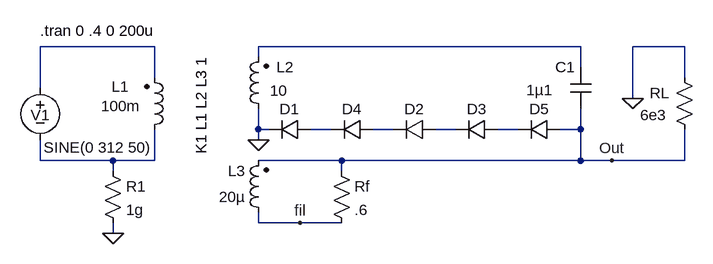
[diagram p0: schematic FteMicrondas.asc]
FteMicrondas.asc, the LTspice schematic file:
Version 4
SHEET 1 880 680
WIRE 0 112 -176 112
WIRE 656 112 160 112
WIRE 816 112 736 112
WIRE 160 128 160 112
WIRE 656 144 656 112
WIRE 0 160 0 112
WIRE 816 160 816 112
WIRE -176 176 -176 112
WIRE 736 192 736 112
WIRE 160 240 160 208
WIRE 176 240 160 240
WIRE 272 240 240 240
WIRE 368 240 336 240
WIRE 464 240 432 240
WIRE 560 240 528 240
WIRE 656 240 656 208
WIRE 656 240 624 240
WIRE 160 256 160 240
WIRE -176 288 -176 256
WIRE -64 288 -176 288
WIRE 0 288 0 240
WIRE 0 288 -64 288
WIRE 288 288 160 288
WIRE 656 288 656 240
WIRE 656 288 288 288
WIRE 704 288 656 288
WIRE 816 288 816 240
WIRE 816 288 704 288
WIRE -64 304 -64 288
WIRE 288 304 288 288
WIRE 160 384 160 368
WIRE 224 384 160 384
WIRE 288 384 224 384
WIRE -64 400 -64 384
FLAG 160 256 0
FLAG -64 400 0
FLAG 704 288 Out
FLAG 224 384 fil
FLAG 736 192 0
SYMBOL ind2 176 224 R180
WINDOW 0 -39 80 Left 0
WINDOW 3 -29 44 Left 0
SYMATTR InstName L2
SYMATTR Value 10
SYMATTR SpiceLine Rser=1
SYMBOL ind2 176 384 R180
WINDOW 0 36 80 Left 0
WINDOW 3 36 40 Left 0
SYMATTR InstName L3
SYMATTR Value 20µ
SYMBOL ind2 -16 256 M180
WINDOW 0 -50 82 Left 0
WINDOW 3 -66 52 Left 0
SYMATTR InstName L1
SYMATTR Value 100m
SYMATTR SpiceLine Rser=.1
SYMBOL voltage -176 160 R0
WINDOW 0 -15 58 Left 0
WINDOW 3 5 108 Left 0
WINDOW 123 0 0 Left 0
WINDOW 39 0 0 Left 0
SYMATTR InstName V1
SYMATTR Value SINE(0 312 50)
SYMBOL res -80 288 R0
SYMATTR InstName R1
SYMATTR Value 1g
SYMBOL diode 240 256 M270
WINDOW 0 32 32 VTop 0
WINDOW 3 59 -30 Invisible 0
SYMATTR InstName D1
SYMATTR Value MR760
SYMBOL cap 672 208 R180
WINDOW 0 24 64 Left 0
WINDOW 3 59 29 Left 0
SYMATTR InstName C1
SYMATTR Value 1µ1
SYMBOL res 800 144 R0
WINDOW 0 -38 40 Left 0
WINDOW 3 -52 74 Left 0
SYMATTR InstName RL
SYMATTR Value 6e3
SYMBOL diode 432 256 M270
WINDOW 0 32 32 VTop 0
WINDOW 3 59 -30 Invisible 0
SYMATTR InstName D2
SYMATTR Value MR760
SYMBOL diode 528 256 M270
WINDOW 0 32 32 VTop 0
WINDOW 3 59 -30 Invisible 0
SYMATTR InstName D3
SYMATTR Value MR760
SYMBOL res 272 288 R0
SYMATTR InstName Rf
SYMATTR Value .6
SYMBOL diode 336 256 M270
WINDOW 0 32 32 VTop 0
WINDOW 3 59 -30 Invisible 0
SYMATTR InstName D4
SYMATTR Value MR760
SYMBOL diode 624 256 M270
WINDOW 0 32 32 VTop 0
WINDOW 3 59 -30 Invisible 0
SYMATTR InstName D5
SYMATTR Value MR760
TEXT 72 128 VRight 0 !K1 L1 L2 L3 1
TEXT -176 88 Left 0 !.tran 0 .4 0 200u

The netlist it stands for:
* FteMicrondas.asc
L2 0 N002 10 Rser=1
L3 fil Out 20µ
L1 N007 N001 100m Rser=.1
V1 N001 N007 SINE(0 312 50)
R1 N007 0 1g
D1 N003 0 MR760
C1 Out N002 1µ1
RL 0 Out 6e3
D2 N005 N004 MR760
D3 N006 N005 MR760
Rf Out fil .6
D4 N004 N003 MR760
D5 Out N006 MR760
.model D D
.lib standard.dio
K1 L1 L2 L3 1
.tran 0 .4 0 200u
.backanno
.end